# Altium schematic sheet FlatSat Half 1.SchDoc
size A2
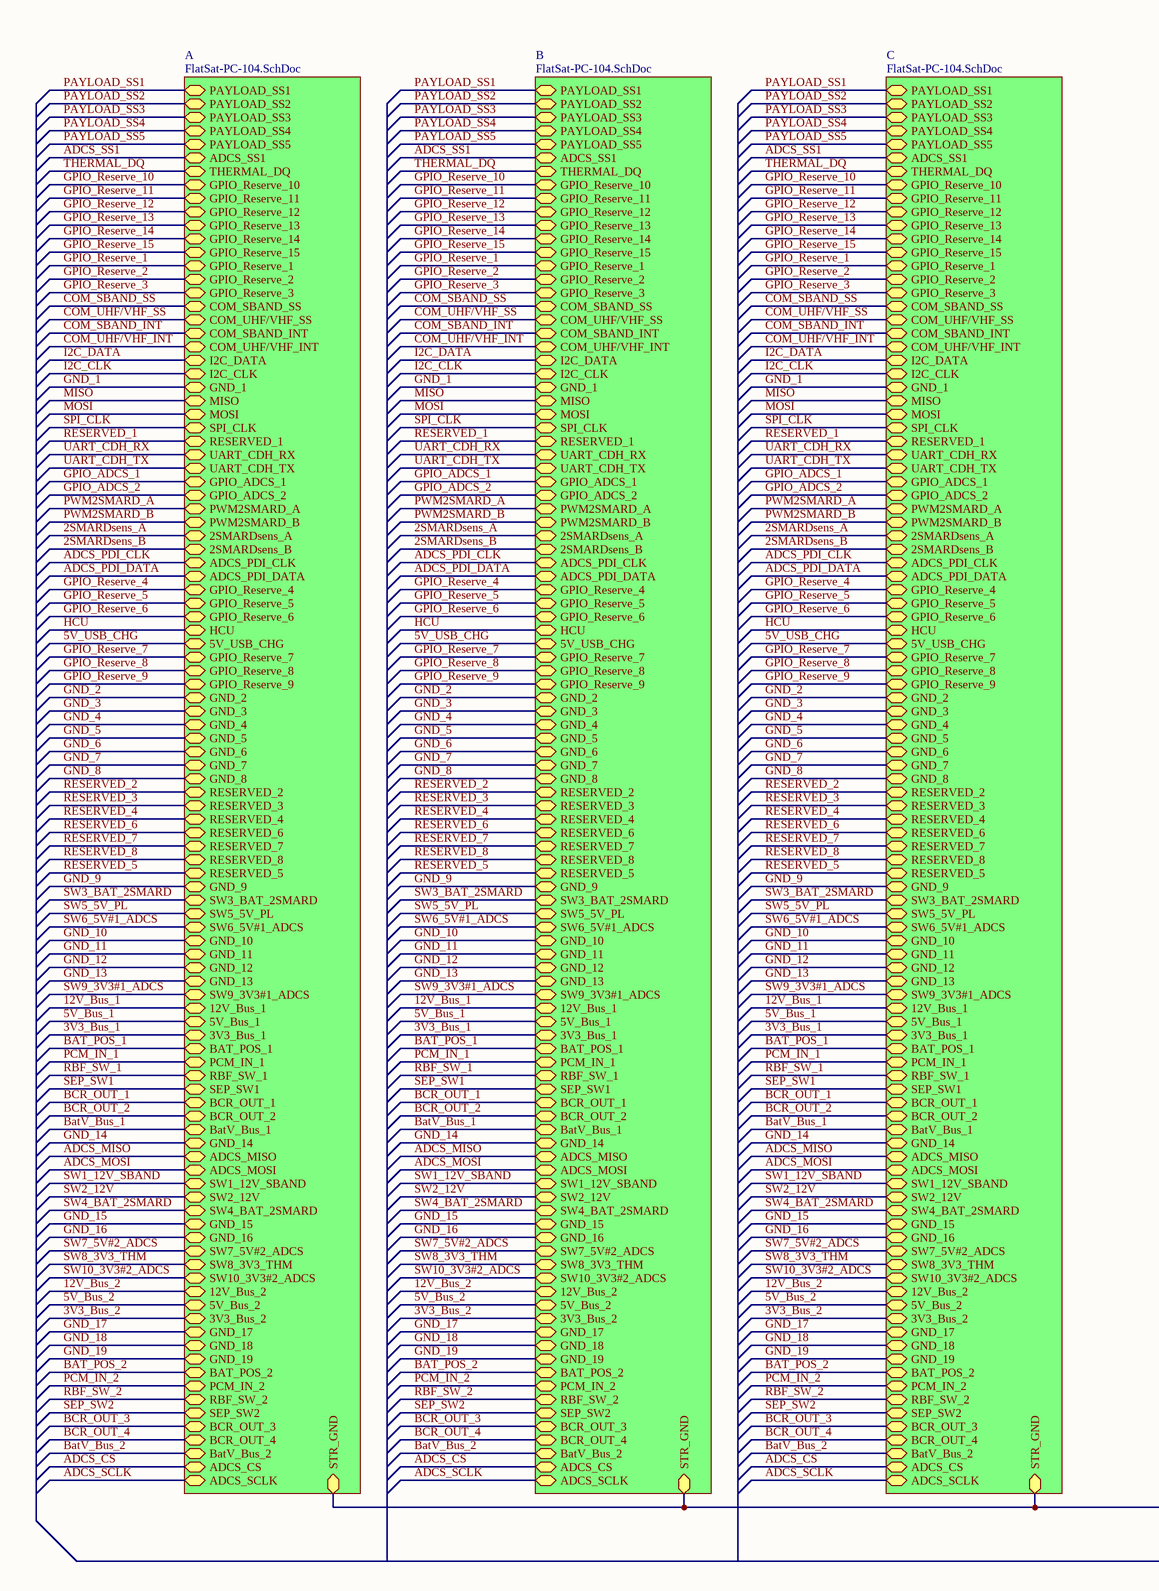
[diagram p0: FlatSat Half 1.SchDoc, left]
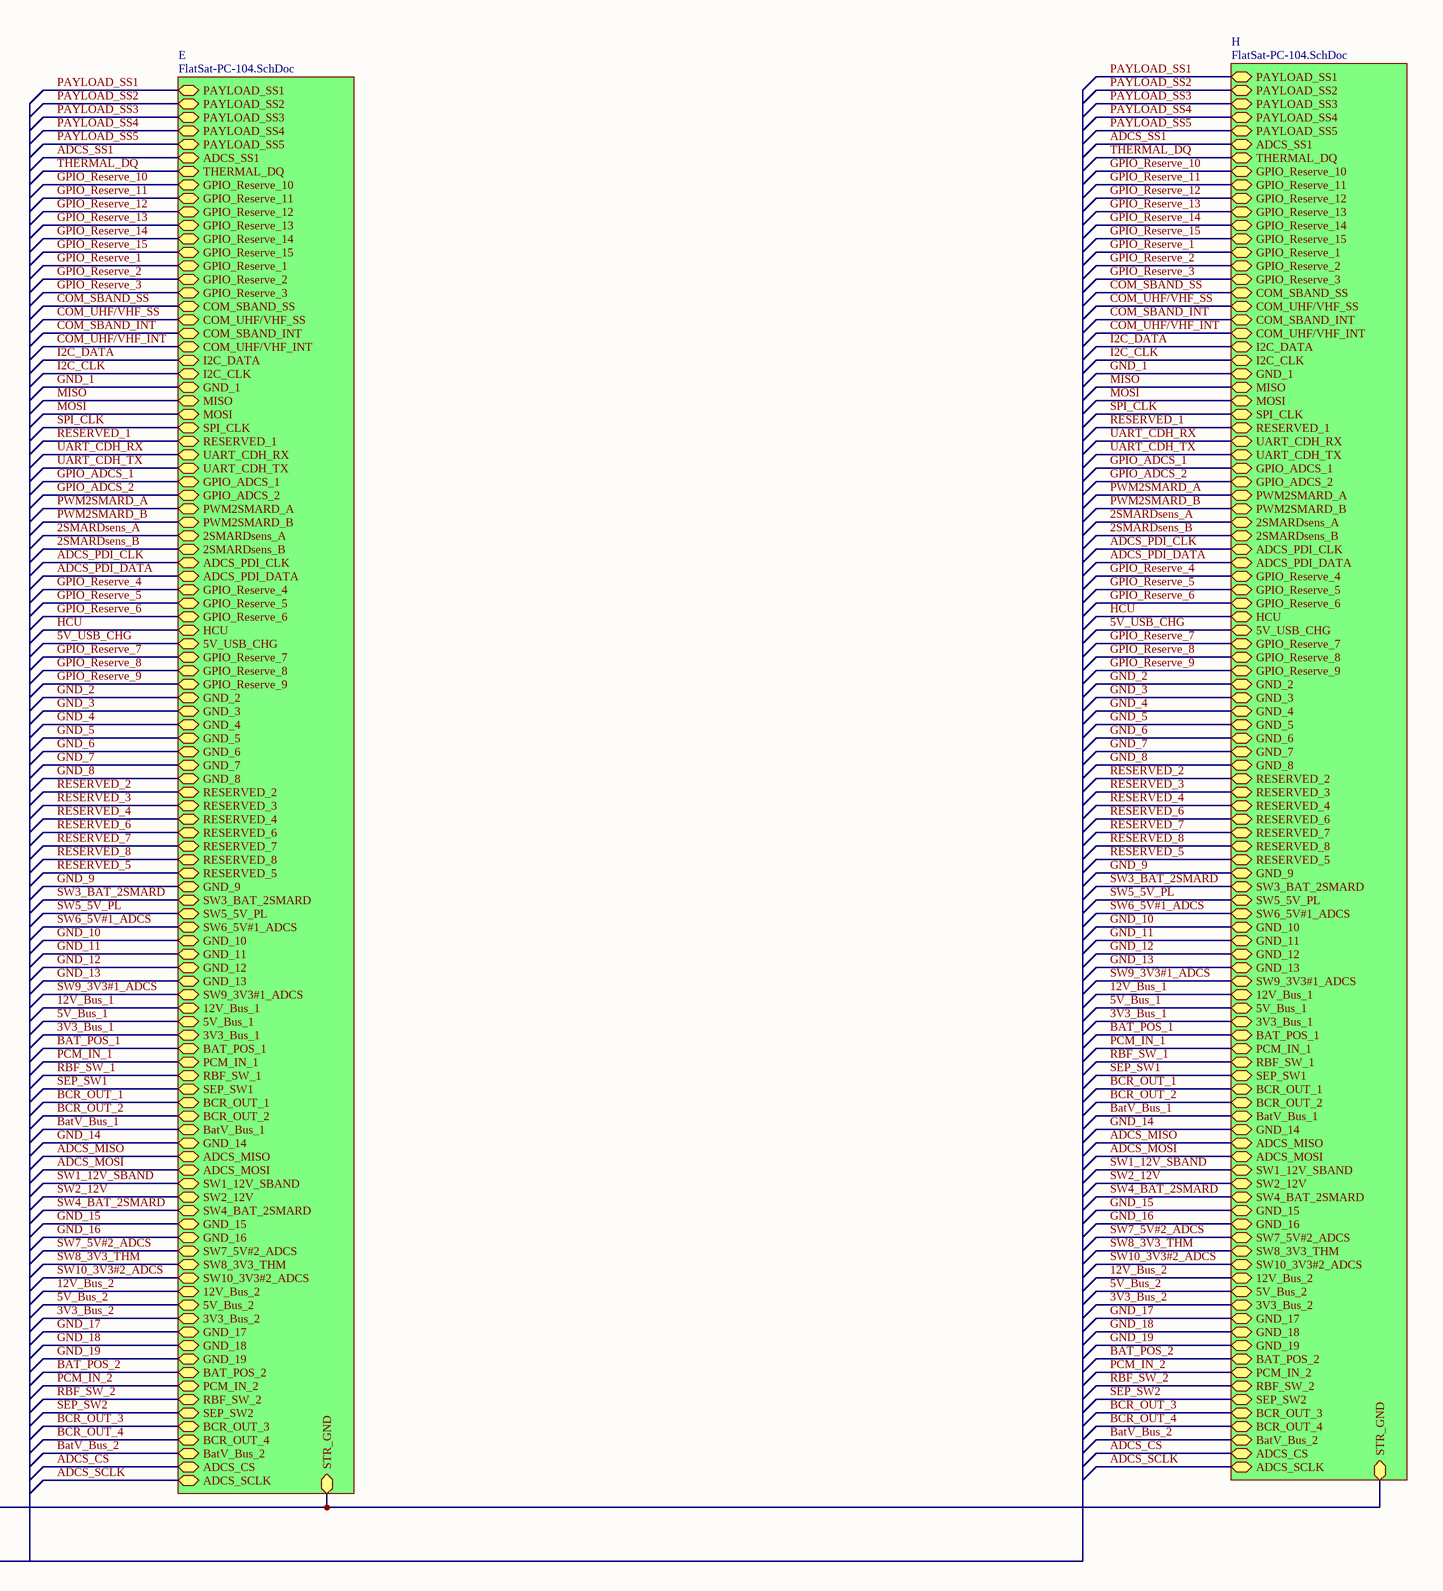
[diagram p1: FlatSat Half 1.SchDoc, right]

## Sub-sheets
A = FlatSat-PC-104.SchDoc: PAYLOAD_SS1 (bidir), PAYLOAD_SS2 (bidir), PAYLOAD_SS3 (bidir), PAYLOAD_SS4 (bidir), PAYLOAD_SS5 (bidir), ADCS_SS1 (bidir), THERMAL_DQ (bidir), GPIO_Reserve_10 (bidir), GPIO_Reserve_11 (bidir), GPIO_Reserve_12 (bidir), GPIO_Reserve_13 (bidir), GPIO_Reserve_14 (bidir), GPIO_Reserve_15 (bidir), GPIO_Reserve_1 (bidir), GPIO_Reserve_2 (bidir), GPIO_Reserve_3 (bidir), COM_SBAND_SS (bidir), COM_UHF/VHF_SS (bidir), COM_SBAND_INT (bidir), COM_UHF/VHF_INT (bidir), I2C_DATA (bidir), I2C_CLK (bidir), GND_1 (bidir), MISO (bidir), MOSI (bidir), SPI_CLK (bidir), RESERVED_1 (bidir), UART_CDH_RX (bidir), UART_CDH_TX (bidir), GPIO_ADCS_1 (bidir), GPIO_ADCS_2 (bidir), PWM2SMARD_A (bidir), PWM2SMARD_B (bidir), 2SMARDsens_A (bidir), 2SMARDsens_B (bidir), ADCS_PDI_CLK (bidir), ADCS_PDI_DATA (bidir), GPIO_Reserve_4 (bidir), GPIO_Reserve_5 (bidir), GPIO_Reserve_6 (bidir), HCU (bidir), 5V_USB_CHG (bidir), GPIO_Reserve_7 (bidir), GPIO_Reserve_8 (bidir), GPIO_Reserve_9 (bidir), GND_2 (bidir), GND_3 (bidir), GND_4 (bidir), GND_5 (bidir), GND_6 (bidir), GND_7 (bidir), GND_8 (bidir), RESERVED_2 (bidir), RESERVED_3 (bidir), RESERVED_4 (bidir), RESERVED_6 (bidir), RESERVED_7 (bidir), RESERVED_8 (bidir), RESERVED_5 (bidir), GND_9 (bidir), SW3_BAT_2SMARD (bidir), SW5_5V_PL (bidir), SW6_5V#1_ADCS (bidir), GND_10 (bidir), GND_11 (bidir), GND_12 (bidir), GND_13 (bidir), SW9_3V3#1_ADCS (bidir), 12V_Bus_1 (bidir), 5V_Bus_1 (bidir), 3V3_Bus_1 (bidir), BAT_POS_1 (bidir), PCM_IN_1 (bidir), RBF_SW_1 (bidir), SEP_SW1 (bidir), BCR_OUT_1 (bidir), BCR_OUT_2 (bidir), BatV_Bus_1 (bidir), GND_14 (bidir), ADCS_MISO (bidir), ADCS_MOSI (bidir), SW1_12V_SBAND (bidir), SW2_12V (bidir), SW4_BAT_2SMARD (bidir), GND_15 (bidir), GND_16 (bidir), SW7_5V#2_ADCS (bidir), SW8_3V3_THM (bidir), SW10_3V3#2_ADCS (bidir), 12V_Bus_2 (bidir), 5V_Bus_2 (bidir), 3V3_Bus_2 (bidir), GND_17 (bidir), GND_18 (bidir), GND_19 (bidir), BAT_POS_2 (bidir), PCM_IN_2 (bidir), RBF_SW_2 (bidir), SEP_SW2 (bidir), BCR_OUT_3 (bidir), BCR_OUT_4 (bidir), BatV_Bus_2 (bidir), ADCS_CS (bidir), ADCS_SCLK (bidir), STR_GND (bidir)
B = FlatSat-PC-104.SchDoc: PAYLOAD_SS1 (bidir), PAYLOAD_SS2 (bidir), PAYLOAD_SS3 (bidir), PAYLOAD_SS4 (bidir), PAYLOAD_SS5 (bidir), ADCS_SS1 (bidir), THERMAL_DQ (bidir), GPIO_Reserve_10 (bidir), GPIO_Reserve_11 (bidir), GPIO_Reserve_12 (bidir), GPIO_Reserve_13 (bidir), GPIO_Reserve_14 (bidir), GPIO_Reserve_15 (bidir), GPIO_Reserve_1 (bidir), GPIO_Reserve_2 (bidir), GPIO_Reserve_3 (bidir), COM_SBAND_SS (bidir), COM_UHF/VHF_SS (bidir), COM_SBAND_INT (bidir), COM_UHF/VHF_INT (bidir), I2C_DATA (bidir), I2C_CLK (bidir), GND_1 (bidir), MISO (bidir), MOSI (bidir), SPI_CLK (bidir), RESERVED_1 (bidir), UART_CDH_RX (bidir), UART_CDH_TX (bidir), GPIO_ADCS_1 (bidir), GPIO_ADCS_2 (bidir), PWM2SMARD_A (bidir), PWM2SMARD_B (bidir), 2SMARDsens_A (bidir), 2SMARDsens_B (bidir), ADCS_PDI_CLK (bidir), ADCS_PDI_DATA (bidir), GPIO_Reserve_4 (bidir), GPIO_Reserve_5 (bidir), GPIO_Reserve_6 (bidir), HCU (bidir), 5V_USB_CHG (bidir), GPIO_Reserve_7 (bidir), GPIO_Reserve_8 (bidir), GPIO_Reserve_9 (bidir), GND_2 (bidir), GND_3 (bidir), GND_4 (bidir), GND_5 (bidir), GND_6 (bidir), GND_7 (bidir), GND_8 (bidir), RESERVED_2 (bidir), RESERVED_3 (bidir), RESERVED_4 (bidir), RESERVED_6 (bidir), RESERVED_7 (bidir), RESERVED_8 (bidir), RESERVED_5 (bidir), GND_9 (bidir), SW3_BAT_2SMARD (bidir), SW5_5V_PL (bidir), SW6_5V#1_ADCS (bidir), GND_10 (bidir), GND_11 (bidir), GND_12 (bidir), GND_13 (bidir), SW9_3V3#1_ADCS (bidir), 12V_Bus_1 (bidir), 5V_Bus_1 (bidir), 3V3_Bus_1 (bidir), BAT_POS_1 (bidir), PCM_IN_1 (bidir), RBF_SW_1 (bidir), SEP_SW1 (bidir), BCR_OUT_1 (bidir), BCR_OUT_2 (bidir), BatV_Bus_1 (bidir), GND_14 (bidir), ADCS_MISO (bidir), ADCS_MOSI (bidir), SW1_12V_SBAND (bidir), SW2_12V (bidir), SW4_BAT_2SMARD (bidir), GND_15 (bidir), GND_16 (bidir), SW7_5V#2_ADCS (bidir), SW8_3V3_THM (bidir), SW10_3V3#2_ADCS (bidir), 12V_Bus_2 (bidir), 5V_Bus_2 (bidir), 3V3_Bus_2 (bidir), GND_17 (bidir), GND_18 (bidir), GND_19 (bidir), BAT_POS_2 (bidir), PCM_IN_2 (bidir), RBF_SW_2 (bidir), SEP_SW2 (bidir), BCR_OUT_3 (bidir), BCR_OUT_4 (bidir), BatV_Bus_2 (bidir), ADCS_CS (bidir), ADCS_SCLK (bidir), STR_GND (bidir)
C = FlatSat-PC-104.SchDoc: PAYLOAD_SS1 (bidir), PAYLOAD_SS2 (bidir), PAYLOAD_SS3 (bidir), PAYLOAD_SS4 (bidir), PAYLOAD_SS5 (bidir), ADCS_SS1 (bidir), THERMAL_DQ (bidir), GPIO_Reserve_10 (bidir), GPIO_Reserve_11 (bidir), GPIO_Reserve_12 (bidir), GPIO_Reserve_13 (bidir), GPIO_Reserve_14 (bidir), GPIO_Reserve_15 (bidir), GPIO_Reserve_1 (bidir), GPIO_Reserve_2 (bidir), GPIO_Reserve_3 (bidir), COM_SBAND_SS (bidir), COM_UHF/VHF_SS (bidir), COM_SBAND_INT (bidir), COM_UHF/VHF_INT (bidir), I2C_DATA (bidir), I2C_CLK (bidir), GND_1 (bidir), MISO (bidir), MOSI (bidir), SPI_CLK (bidir), RESERVED_1 (bidir), UART_CDH_RX (bidir), UART_CDH_TX (bidir), GPIO_ADCS_1 (bidir), GPIO_ADCS_2 (bidir), PWM2SMARD_A (bidir), PWM2SMARD_B (bidir), 2SMARDsens_A (bidir), 2SMARDsens_B (bidir), ADCS_PDI_CLK (bidir), ADCS_PDI_DATA (bidir), GPIO_Reserve_4 (bidir), GPIO_Reserve_5 (bidir), GPIO_Reserve_6 (bidir), HCU (bidir), 5V_USB_CHG (bidir), GPIO_Reserve_7 (bidir), GPIO_Reserve_8 (bidir), GPIO_Reserve_9 (bidir), GND_2 (bidir), GND_3 (bidir), GND_4 (bidir), GND_5 (bidir), GND_6 (bidir), GND_7 (bidir), GND_8 (bidir), RESERVED_2 (bidir), RESERVED_3 (bidir), RESERVED_4 (bidir), RESERVED_6 (bidir), RESERVED_7 (bidir), RESERVED_8 (bidir), RESERVED_5 (bidir), GND_9 (bidir), SW3_BAT_2SMARD (bidir), SW5_5V_PL (bidir), SW6_5V#1_ADCS (bidir), GND_10 (bidir), GND_11 (bidir), GND_12 (bidir), GND_13 (bidir), SW9_3V3#1_ADCS (bidir), 12V_Bus_1 (bidir), 5V_Bus_1 (bidir), 3V3_Bus_1 (bidir), BAT_POS_1 (bidir), PCM_IN_1 (bidir), RBF_SW_1 (bidir), SEP_SW1 (bidir), BCR_OUT_1 (bidir), BCR_OUT_2 (bidir), BatV_Bus_1 (bidir), GND_14 (bidir), ADCS_MISO (bidir), ADCS_MOSI (bidir), SW1_12V_SBAND (bidir), SW2_12V (bidir), SW4_BAT_2SMARD (bidir), GND_15 (bidir), GND_16 (bidir), SW7_5V#2_ADCS (bidir), SW8_3V3_THM (bidir), SW10_3V3#2_ADCS (bidir), 12V_Bus_2 (bidir), 5V_Bus_2 (bidir), 3V3_Bus_2 (bidir), GND_17 (bidir), GND_18 (bidir), GND_19 (bidir), BAT_POS_2 (bidir), PCM_IN_2 (bidir), RBF_SW_2 (bidir), SEP_SW2 (bidir), BCR_OUT_3 (bidir), BCR_OUT_4 (bidir), BatV_Bus_2 (bidir), ADCS_CS (bidir), ADCS_SCLK (bidir), STR_GND (bidir)
E = FlatSat-PC-104.SchDoc: PAYLOAD_SS1 (bidir), PAYLOAD_SS2 (bidir), PAYLOAD_SS3 (bidir), PAYLOAD_SS4 (bidir), PAYLOAD_SS5 (bidir), ADCS_SS1 (bidir), THERMAL_DQ (bidir), GPIO_Reserve_10 (bidir), GPIO_Reserve_11 (bidir), GPIO_Reserve_12 (bidir), GPIO_Reserve_13 (bidir), GPIO_Reserve_14 (bidir), GPIO_Reserve_15 (bidir), GPIO_Reserve_1 (bidir), GPIO_Reserve_2 (bidir), GPIO_Reserve_3 (bidir), COM_SBAND_SS (bidir), COM_UHF/VHF_SS (bidir), COM_SBAND_INT (bidir), COM_UHF/VHF_INT (bidir), I2C_DATA (bidir), I2C_CLK (bidir), GND_1 (bidir), MISO (bidir), MOSI (bidir), SPI_CLK (bidir), RESERVED_1 (bidir), UART_CDH_RX (bidir), UART_CDH_TX (bidir), GPIO_ADCS_1 (bidir), GPIO_ADCS_2 (bidir), PWM2SMARD_A (bidir), PWM2SMARD_B (bidir), 2SMARDsens_A (bidir), 2SMARDsens_B (bidir), ADCS_PDI_CLK (bidir), ADCS_PDI_DATA (bidir), GPIO_Reserve_4 (bidir), GPIO_Reserve_5 (bidir), GPIO_Reserve_6 (bidir), HCU (bidir), 5V_USB_CHG (bidir), GPIO_Reserve_7 (bidir), GPIO_Reserve_8 (bidir), GPIO_Reserve_9 (bidir), GND_2 (bidir), GND_3 (bidir), GND_4 (bidir), GND_5 (bidir), GND_6 (bidir), GND_7 (bidir), GND_8 (bidir), RESERVED_2 (bidir), RESERVED_3 (bidir), RESERVED_4 (bidir), RESERVED_6 (bidir), RESERVED_7 (bidir), RESERVED_8 (bidir), RESERVED_5 (bidir), GND_9 (bidir), SW3_BAT_2SMARD (bidir), SW5_5V_PL (bidir), SW6_5V#1_ADCS (bidir), GND_10 (bidir), GND_11 (bidir), GND_12 (bidir), GND_13 (bidir), SW9_3V3#1_ADCS (bidir), 12V_Bus_1 (bidir), 5V_Bus_1 (bidir), 3V3_Bus_1 (bidir), BAT_POS_1 (bidir), PCM_IN_1 (bidir), RBF_SW_1 (bidir), SEP_SW1 (bidir), BCR_OUT_1 (bidir), BCR_OUT_2 (bidir), BatV_Bus_1 (bidir), GND_14 (bidir), ADCS_MISO (bidir), ADCS_MOSI (bidir), SW1_12V_SBAND (bidir), SW2_12V (bidir), SW4_BAT_2SMARD (bidir), GND_15 (bidir), GND_16 (bidir), SW7_5V#2_ADCS (bidir), SW8_3V3_THM (bidir), SW10_3V3#2_ADCS (bidir), 12V_Bus_2 (bidir), 5V_Bus_2 (bidir), 3V3_Bus_2 (bidir), GND_17 (bidir), GND_18 (bidir), GND_19 (bidir), BAT_POS_2 (bidir), PCM_IN_2 (bidir), RBF_SW_2 (bidir), SEP_SW2 (bidir), BCR_OUT_3 (bidir), BCR_OUT_4 (bidir), BatV_Bus_2 (bidir), ADCS_CS (bidir), ADCS_SCLK (bidir), STR_GND (bidir)
H = FlatSat-PC-104.SchDoc: PAYLOAD_SS1 (bidir), PAYLOAD_SS2 (bidir), PAYLOAD_SS3 (bidir), PAYLOAD_SS4 (bidir), PAYLOAD_SS5 (bidir), ADCS_SS1 (bidir), THERMAL_DQ (bidir), GPIO_Reserve_10 (bidir), GPIO_Reserve_11 (bidir), GPIO_Reserve_12 (bidir), GPIO_Reserve_13 (bidir), GPIO_Reserve_14 (bidir), GPIO_Reserve_15 (bidir), GPIO_Reserve_1 (bidir), GPIO_Reserve_2 (bidir), GPIO_Reserve_3 (bidir), COM_SBAND_SS (bidir), COM_UHF/VHF_SS (bidir), COM_SBAND_INT (bidir), COM_UHF/VHF_INT (bidir), I2C_DATA (bidir), I2C_CLK (bidir), GND_1 (bidir), MISO (bidir), MOSI (bidir), SPI_CLK (bidir), RESERVED_1 (bidir), UART_CDH_RX (bidir), UART_CDH_TX (bidir), GPIO_ADCS_1 (bidir), GPIO_ADCS_2 (bidir), PWM2SMARD_A (bidir), PWM2SMARD_B (bidir), 2SMARDsens_A (bidir), 2SMARDsens_B (bidir), ADCS_PDI_CLK (bidir), ADCS_PDI_DATA (bidir), GPIO_Reserve_4 (bidir), GPIO_Reserve_5 (bidir), GPIO_Reserve_6 (bidir), HCU (bidir), 5V_USB_CHG (bidir), GPIO_Reserve_7 (bidir), GPIO_Reserve_8 (bidir), GPIO_Reserve_9 (bidir), GND_2 (bidir), GND_3 (bidir), GND_4 (bidir), GND_5 (bidir), GND_6 (bidir), GND_7 (bidir), GND_8 (bidir), RESERVED_2 (bidir), RESERVED_3 (bidir), RESERVED_4 (bidir), RESERVED_6 (bidir), RESERVED_7 (bidir), RESERVED_8 (bidir), RESERVED_5 (bidir), GND_9 (bidir), SW3_BAT_2SMARD (bidir), SW5_5V_PL (bidir), SW6_5V#1_ADCS (bidir), GND_10 (bidir), GND_11 (bidir), GND_12 (bidir), GND_13 (bidir), SW9_3V3#1_ADCS (bidir), 12V_Bus_1 (bidir), 5V_Bus_1 (bidir), 3V3_Bus_1 (bidir), BAT_POS_1 (bidir), PCM_IN_1 (bidir), RBF_SW_1 (bidir), SEP_SW1 (bidir), BCR_OUT_1 (bidir), BCR_OUT_2 (bidir), BatV_Bus_1 (bidir), GND_14 (bidir), ADCS_MISO (bidir), ADCS_MOSI (bidir), SW1_12V_SBAND (bidir), SW2_12V (bidir), SW4_BAT_2SMARD (bidir), GND_15 (bidir), GND_16 (bidir), SW7_5V#2_ADCS (bidir), SW8_3V3_THM (bidir), SW10_3V3#2_ADCS (bidir), 12V_Bus_2 (bidir), 5V_Bus_2 (bidir), 3V3_Bus_2 (bidir), GND_17 (bidir), GND_18 (bidir), GND_19 (bidir), BAT_POS_2 (bidir), PCM_IN_2 (bidir), RBF_SW_2 (bidir), SEP_SW2 (bidir), BCR_OUT_3 (bidir), BCR_OUT_4 (bidir), BatV_Bus_2 (bidir), ADCS_CS (bidir), ADCS_SCLK (bidir), STR_GND (bidir)

## Nets
2SMARDsens_A: sheet A/2SMARDsens_A, sheet B/2SMARDsens_A, sheet C/2SMARDsens_A, sheet E/2SMARDsens_A, sheet H/2SMARDsens_A
2SMARDsens_B: sheet A/2SMARDsens_B, sheet B/2SMARDsens_B, sheet C/2SMARDsens_B, sheet E/2SMARDsens_B, sheet H/2SMARDsens_B
3V3_Bus_1: sheet A/3V3_Bus_1, sheet B/3V3_Bus_1, sheet C/3V3_Bus_1, sheet E/3V3_Bus_1, sheet H/3V3_Bus_1
3V3_Bus_2: sheet A/3V3_Bus_2, sheet B/3V3_Bus_2, sheet C/3V3_Bus_2, sheet E/3V3_Bus_2, sheet H/3V3_Bus_2
5V_Bus_1: sheet A/5V_Bus_1, sheet B/5V_Bus_1, sheet C/5V_Bus_1, sheet E/5V_Bus_1, sheet H/5V_Bus_1
5V_Bus_2: sheet A/5V_Bus_2, sheet B/5V_Bus_2, sheet C/5V_Bus_2, sheet E/5V_Bus_2, sheet H/5V_Bus_2
5V_USB_CHG: sheet A/5V_USB_CHG, sheet B/5V_USB_CHG, sheet C/5V_USB_CHG, sheet E/5V_USB_CHG, sheet H/5V_USB_CHG
12V_Bus_1: sheet A/12V_Bus_1, sheet B/12V_Bus_1, sheet C/12V_Bus_1, sheet E/12V_Bus_1, sheet H/12V_Bus_1
12V_Bus_2: sheet A/12V_Bus_2, sheet B/12V_Bus_2, sheet C/12V_Bus_2, sheet E/12V_Bus_2, sheet H/12V_Bus_2
ADCS_CS: sheet A/ADCS_CS, sheet B/ADCS_CS, sheet C/ADCS_CS, sheet E/ADCS_CS, sheet H/ADCS_CS
ADCS_MISO: sheet A/ADCS_MISO, sheet B/ADCS_MISO, sheet C/ADCS_MISO, sheet E/ADCS_MISO, sheet H/ADCS_MISO
ADCS_MOSI: sheet A/ADCS_MOSI, sheet B/ADCS_MOSI, sheet C/ADCS_MOSI, sheet E/ADCS_MOSI, sheet H/ADCS_MOSI
ADCS_PDI_CLK: sheet A/ADCS_PDI_CLK, sheet B/ADCS_PDI_CLK, sheet C/ADCS_PDI_CLK, sheet E/ADCS_PDI_CLK, sheet H/ADCS_PDI_CLK
ADCS_PDI_DATA: sheet A/ADCS_PDI_DATA, sheet B/ADCS_PDI_DATA, sheet C/ADCS_PDI_DATA, sheet E/ADCS_PDI_DATA, sheet H/ADCS_PDI_DATA
ADCS_SCLK: sheet A/ADCS_SCLK, sheet B/ADCS_SCLK, sheet C/ADCS_SCLK, sheet E/ADCS_SCLK, sheet H/ADCS_SCLK
ADCS_SS1: sheet A/ADCS_SS1, sheet B/ADCS_SS1, sheet C/ADCS_SS1, sheet E/ADCS_SS1, sheet H/ADCS_SS1
BAT_POS_1: sheet A/BAT_POS_1, sheet B/BAT_POS_1, sheet C/BAT_POS_1, sheet E/BAT_POS_1, sheet H/BAT_POS_1
BAT_POS_2: sheet A/BAT_POS_2, sheet B/BAT_POS_2, sheet C/BAT_POS_2, sheet E/BAT_POS_2, sheet H/BAT_POS_2
BatV_Bus_1: sheet A/BatV_Bus_1, sheet B/BatV_Bus_1, sheet C/BatV_Bus_1, sheet E/BatV_Bus_1, sheet H/BatV_Bus_1
BatV_Bus_2: sheet A/BatV_Bus_2, sheet B/BatV_Bus_2, sheet C/BatV_Bus_2, sheet E/BatV_Bus_2, sheet H/BatV_Bus_2
BCR_OUT_1: sheet A/BCR_OUT_1, sheet B/BCR_OUT_1, sheet C/BCR_OUT_1, sheet E/BCR_OUT_1, sheet H/BCR_OUT_1
BCR_OUT_2: sheet A/BCR_OUT_2, sheet B/BCR_OUT_2, sheet C/BCR_OUT_2, sheet E/BCR_OUT_2, sheet H/BCR_OUT_2
BCR_OUT_3: sheet A/BCR_OUT_3, sheet B/BCR_OUT_3, sheet C/BCR_OUT_3, sheet E/BCR_OUT_3, sheet H/BCR_OUT_3
BCR_OUT_4: sheet A/BCR_OUT_4, sheet B/BCR_OUT_4, sheet C/BCR_OUT_4, sheet E/BCR_OUT_4, sheet H/BCR_OUT_4
COM_SBAND_INT: sheet A/COM_SBAND_INT, sheet B/COM_SBAND_INT, sheet C/COM_SBAND_INT, sheet E/COM_SBAND_INT, sheet H/COM_SBAND_INT
COM_SBAND_SS: sheet A/COM_SBAND_SS, sheet B/COM_SBAND_SS, sheet C/COM_SBAND_SS, sheet E/COM_SBAND_SS, sheet H/COM_SBAND_SS
COM_UHF/VHF_INT: sheet A/COM_UHF/VHF_INT, sheet B/COM_UHF/VHF_INT, sheet C/COM_UHF/VHF_INT, sheet E/COM_UHF/VHF_INT, sheet H/COM_UHF/VHF_INT
COM_UHF/VHF_SS: sheet A/COM_UHF/VHF_SS, sheet B/COM_UHF/VHF_SS, sheet C/COM_UHF/VHF_SS, sheet E/COM_UHF/VHF_SS, sheet H/COM_UHF/VHF_SS
GND_1: sheet A/GND_1, sheet B/GND_1, sheet C/GND_1, sheet E/GND_1, sheet H/GND_1
GND_2: sheet A/GND_2, sheet B/GND_2, sheet C/GND_2, sheet E/GND_2, sheet H/GND_2
GND_3: sheet A/GND_3, sheet B/GND_3, sheet C/GND_3, sheet E/GND_3, sheet H/GND_3
GND_4: sheet A/GND_4, sheet B/GND_4, sheet C/GND_4, sheet E/GND_4, sheet H/GND_4
GND_5: sheet A/GND_5, sheet B/GND_5, sheet C/GND_5, sheet E/GND_5, sheet H/GND_5
GND_6: sheet A/GND_6, sheet B/GND_6, sheet C/GND_6, sheet E/GND_6, sheet H/GND_6
GND_7: sheet A/GND_7, sheet B/GND_7, sheet C/GND_7, sheet E/GND_7, sheet H/GND_7
GND_8: sheet A/GND_8, sheet B/GND_8, sheet C/GND_8, sheet E/GND_8, sheet H/GND_8
GND_9: sheet A/GND_9, sheet B/GND_9, sheet C/GND_9, sheet E/GND_9, sheet H/GND_9
GND_10: sheet A/GND_10, sheet B/GND_10, sheet C/GND_10, sheet E/GND_10, sheet H/GND_10
GND_11: sheet A/GND_11, sheet B/GND_11, sheet C/GND_11, sheet E/GND_11, sheet H/GND_11
GND_12: sheet A/GND_12, sheet B/GND_12, sheet C/GND_12, sheet E/GND_12, sheet H/GND_12
GND_13: sheet A/GND_13, sheet B/GND_13, sheet C/GND_13, sheet E/GND_13, sheet H/GND_13
GND_14: sheet A/GND_14, sheet B/GND_14, sheet C/GND_14, sheet E/GND_14, sheet H/GND_14
GND_15: sheet A/GND_15, sheet B/GND_15, sheet C/GND_15, sheet E/GND_15, sheet H/GND_15
GND_16: sheet A/GND_16, sheet B/GND_16, sheet C/GND_16, sheet E/GND_16, sheet H/GND_16
GND_17: sheet A/GND_17, sheet B/GND_17, sheet C/GND_17, sheet E/GND_17, sheet H/GND_17
GND_18: sheet A/GND_18, sheet B/GND_18, sheet C/GND_18, sheet E/GND_18, sheet H/GND_18
GND_19: sheet A/GND_19, sheet B/GND_19, sheet C/GND_19, sheet E/GND_19, sheet H/GND_19
GPIO_ADCS_1: sheet A/GPIO_ADCS_1, sheet B/GPIO_ADCS_1, sheet C/GPIO_ADCS_1, sheet E/GPIO_ADCS_1, sheet H/GPIO_ADCS_1
GPIO_ADCS_2: sheet A/GPIO_ADCS_2, sheet B/GPIO_ADCS_2, sheet C/GPIO_ADCS_2, sheet E/GPIO_ADCS_2, sheet H/GPIO_ADCS_2
GPIO_Reserve_1: sheet A/GPIO_Reserve_1, sheet B/GPIO_Reserve_1, sheet C/GPIO_Reserve_1, sheet E/GPIO_Reserve_1, sheet H/GPIO_Reserve_1
GPIO_Reserve_2: sheet A/GPIO_Reserve_2, sheet B/GPIO_Reserve_2, sheet C/GPIO_Reserve_2, sheet E/GPIO_Reserve_2, sheet H/GPIO_Reserve_2
GPIO_Reserve_3: sheet A/GPIO_Reserve_3, sheet B/GPIO_Reserve_3, sheet C/GPIO_Reserve_3, sheet E/GPIO_Reserve_3, sheet H/GPIO_Reserve_3
GPIO_Reserve_4: sheet A/GPIO_Reserve_4, sheet B/GPIO_Reserve_4, sheet C/GPIO_Reserve_4, sheet E/GPIO_Reserve_4, sheet H/GPIO_Reserve_4
GPIO_Reserve_5: sheet A/GPIO_Reserve_5, sheet B/GPIO_Reserve_5, sheet C/GPIO_Reserve_5, sheet E/GPIO_Reserve_5, sheet H/GPIO_Reserve_5
GPIO_Reserve_6: sheet A/GPIO_Reserve_6, sheet B/GPIO_Reserve_6, sheet C/GPIO_Reserve_6, sheet E/GPIO_Reserve_6, sheet H/GPIO_Reserve_6
GPIO_Reserve_7: sheet A/GPIO_Reserve_7, sheet B/GPIO_Reserve_7, sheet C/GPIO_Reserve_7, sheet E/GPIO_Reserve_7, sheet H/GPIO_Reserve_7
GPIO_Reserve_8: sheet A/GPIO_Reserve_8, sheet B/GPIO_Reserve_8, sheet C/GPIO_Reserve_8, sheet E/GPIO_Reserve_8, sheet H/GPIO_Reserve_8
GPIO_Reserve_9: sheet A/GPIO_Reserve_9, sheet B/GPIO_Reserve_9, sheet C/GPIO_Reserve_9, sheet E/GPIO_Reserve_9, sheet H/GPIO_Reserve_9
GPIO_Reserve_10: sheet A/GPIO_Reserve_10, sheet B/GPIO_Reserve_10, sheet C/GPIO_Reserve_10, sheet E/GPIO_Reserve_10, sheet H/GPIO_Reserve_10
GPIO_Reserve_11: sheet A/GPIO_Reserve_11, sheet B/GPIO_Reserve_11, sheet C/GPIO_Reserve_11, sheet E/GPIO_Reserve_11, sheet H/GPIO_Reserve_11
GPIO_Reserve_12: sheet A/GPIO_Reserve_12, sheet B/GPIO_Reserve_12, sheet C/GPIO_Reserve_12, sheet E/GPIO_Reserve_12, sheet H/GPIO_Reserve_12
GPIO_Reserve_13: sheet A/GPIO_Reserve_13, sheet B/GPIO_Reserve_13, sheet C/GPIO_Reserve_13, sheet E/GPIO_Reserve_13, sheet H/GPIO_Reserve_13
GPIO_Reserve_14: sheet A/GPIO_Reserve_14, sheet B/GPIO_Reserve_14, sheet C/GPIO_Reserve_14, sheet E/GPIO_Reserve_14, sheet H/GPIO_Reserve_14
GPIO_Reserve_15: sheet A/GPIO_Reserve_15, sheet B/GPIO_Reserve_15, sheet C/GPIO_Reserve_15, sheet E/GPIO_Reserve_15, sheet H/GPIO_Reserve_15
HCU: sheet A/HCU, sheet B/HCU, sheet C/HCU, sheet E/HCU, sheet H/HCU
I2C_CLK: sheet A/I2C_CLK, sheet B/I2C_CLK, sheet C/I2C_CLK, sheet E/I2C_CLK, sheet H/I2C_CLK
I2C_DATA: sheet A/I2C_DATA, sheet B/I2C_DATA, sheet C/I2C_DATA, sheet E/I2C_DATA, sheet H/I2C_DATA
MISO: sheet A/MISO, sheet B/MISO, sheet C/MISO, sheet E/MISO, sheet H/MISO
MOSI: sheet A/MOSI, sheet B/MOSI, sheet C/MOSI, sheet E/MOSI, sheet H/MOSI
PAYLOAD_SS1: sheet A/PAYLOAD_SS1, sheet B/PAYLOAD_SS1, sheet C/PAYLOAD_SS1, sheet E/PAYLOAD_SS1, sheet H/PAYLOAD_SS1
PAYLOAD_SS2: sheet A/PAYLOAD_SS2, sheet B/PAYLOAD_SS2, sheet C/PAYLOAD_SS2, sheet E/PAYLOAD_SS2, sheet H/PAYLOAD_SS2
PAYLOAD_SS3: sheet A/PAYLOAD_SS3, sheet B/PAYLOAD_SS3, sheet C/PAYLOAD_SS3, sheet E/PAYLOAD_SS3, sheet H/PAYLOAD_SS3
PAYLOAD_SS4: sheet A/PAYLOAD_SS4, sheet B/PAYLOAD_SS4, sheet C/PAYLOAD_SS4, sheet E/PAYLOAD_SS4, sheet H/PAYLOAD_SS4
PAYLOAD_SS5: sheet A/PAYLOAD_SS5, sheet B/PAYLOAD_SS5, sheet C/PAYLOAD_SS5, sheet E/PAYLOAD_SS5, sheet H/PAYLOAD_SS5
PCM_IN_1: sheet A/PCM_IN_1, sheet B/PCM_IN_1, sheet C/PCM_IN_1, sheet E/PCM_IN_1, sheet H/PCM_IN_1
PCM_IN_2: sheet A/PCM_IN_2, sheet B/PCM_IN_2, sheet C/PCM_IN_2, sheet E/PCM_IN_2, sheet H/PCM_IN_2
PWM2SMARD_A: sheet A/PWM2SMARD_A, sheet B/PWM2SMARD_A, sheet C/PWM2SMARD_A, sheet E/PWM2SMARD_A, sheet H/PWM2SMARD_A
PWM2SMARD_B: sheet A/PWM2SMARD_B, sheet B/PWM2SMARD_B, sheet C/PWM2SMARD_B, sheet E/PWM2SMARD_B, sheet H/PWM2SMARD_B
RBF_SW_1: sheet A/RBF_SW_1, sheet B/RBF_SW_1, sheet C/RBF_SW_1, sheet E/RBF_SW_1, sheet H/RBF_SW_1
RBF_SW_2: sheet A/RBF_SW_2, sheet B/RBF_SW_2, sheet C/RBF_SW_2, sheet E/RBF_SW_2, sheet H/RBF_SW_2
RESERVED_1: sheet A/RESERVED_1, sheet B/RESERVED_1, sheet C/RESERVED_1, sheet E/RESERVED_1, sheet H/RESERVED_1
RESERVED_2: sheet A/RESERVED_2, sheet B/RESERVED_2, sheet C/RESERVED_2, sheet E/RESERVED_2, sheet H/RESERVED_2
RESERVED_3: sheet A/RESERVED_3, sheet B/RESERVED_3, sheet C/RESERVED_3, sheet E/RESERVED_3, sheet H/RESERVED_3
RESERVED_4: sheet A/RESERVED_4, sheet B/RESERVED_4, sheet C/RESERVED_4, sheet E/RESERVED_4, sheet H/RESERVED_4
RESERVED_5: sheet A/RESERVED_5, sheet B/RESERVED_5, sheet C/RESERVED_5, sheet E/RESERVED_5, sheet H/RESERVED_5
RESERVED_6: sheet A/RESERVED_6, sheet B/RESERVED_6, sheet C/RESERVED_6, sheet E/RESERVED_6, sheet H/RESERVED_6
RESERVED_7: sheet A/RESERVED_7, sheet B/RESERVED_7, sheet C/RESERVED_7, sheet E/RESERVED_7, sheet H/RESERVED_7
RESERVED_8: sheet A/RESERVED_8, sheet B/RESERVED_8, sheet C/RESERVED_8, sheet E/RESERVED_8, sheet H/RESERVED_8
SEP_SW1: sheet A/SEP_SW1, sheet B/SEP_SW1, sheet C/SEP_SW1, sheet E/SEP_SW1, sheet H/SEP_SW1
SEP_SW2: sheet A/SEP_SW2, sheet B/SEP_SW2, sheet C/SEP_SW2, sheet E/SEP_SW2, sheet H/SEP_SW2
SPI_CLK: sheet A/SPI_CLK, sheet B/SPI_CLK, sheet C/SPI_CLK, sheet E/SPI_CLK, sheet H/SPI_CLK
SW1_12V_SBAND: sheet A/SW1_12V_SBAND, sheet B/SW1_12V_SBAND, sheet C/SW1_12V_SBAND, sheet E/SW1_12V_SBAND, sheet H/SW1_12V_SBAND
SW2_12V: sheet A/SW2_12V, sheet B/SW2_12V, sheet C/SW2_12V, sheet E/SW2_12V, sheet H/SW2_12V
SW3_BAT_2SMARD: sheet A/SW3_BAT_2SMARD, sheet B/SW3_BAT_2SMARD, sheet C/SW3_BAT_2SMARD, sheet E/SW3_BAT_2SMARD, sheet H/SW3_BAT_2SMARD
SW4_BAT_2SMARD: sheet A/SW4_BAT_2SMARD, sheet B/SW4_BAT_2SMARD, sheet C/SW4_BAT_2SMARD, sheet E/SW4_BAT_2SMARD, sheet H/SW4_BAT_2SMARD
SW5_5V_PL: sheet A/SW5_5V_PL, sheet B/SW5_5V_PL, sheet C/SW5_5V_PL, sheet E/SW5_5V_PL, sheet H/SW5_5V_PL
SW6_5V#1_ADCS: sheet A/SW6_5V#1_ADCS, sheet B/SW6_5V#1_ADCS, sheet C/SW6_5V#1_ADCS, sheet E/SW6_5V#1_ADCS, sheet H/SW6_5V#1_ADCS
SW7_5V#2_ADCS: sheet A/SW7_5V#2_ADCS, sheet B/SW7_5V#2_ADCS, sheet C/SW7_5V#2_ADCS, sheet E/SW7_5V#2_ADCS, sheet H/SW7_5V#2_ADCS
SW8_3V3_THM: sheet A/SW8_3V3_THM, sheet B/SW8_3V3_THM, sheet C/SW8_3V3_THM, sheet E/SW8_3V3_THM, sheet H/SW8_3V3_THM
SW9_3V3#1_ADCS: sheet A/SW9_3V3#1_ADCS, sheet B/SW9_3V3#1_ADCS, sheet C/SW9_3V3#1_ADCS, sheet E/SW9_3V3#1_ADCS, sheet H/SW9_3V3#1_ADCS
SW10_3V3#2_ADCS: sheet A/SW10_3V3#2_ADCS, sheet B/SW10_3V3#2_ADCS, sheet C/SW10_3V3#2_ADCS, sheet E/SW10_3V3#2_ADCS, sheet H/SW10_3V3#2_ADCS
THERMAL_DQ: sheet A/THERMAL_DQ, sheet B/THERMAL_DQ, sheet C/THERMAL_DQ, sheet E/THERMAL_DQ, sheet H/THERMAL_DQ
UART_CDH_RX: sheet A/UART_CDH_RX, sheet B/UART_CDH_RX, sheet C/UART_CDH_RX, sheet E/UART_CDH_RX, sheet H/UART_CDH_RX
UART_CDH_TX: sheet A/UART_CDH_TX, sheet B/UART_CDH_TX, sheet C/UART_CDH_TX, sheet E/UART_CDH_TX, sheet H/UART_CDH_TX
(unnamed): sheet A/STR_GND, sheet B/STR_GND, sheet C/STR_GND, sheet E/STR_GND, sheet H/STR_GND